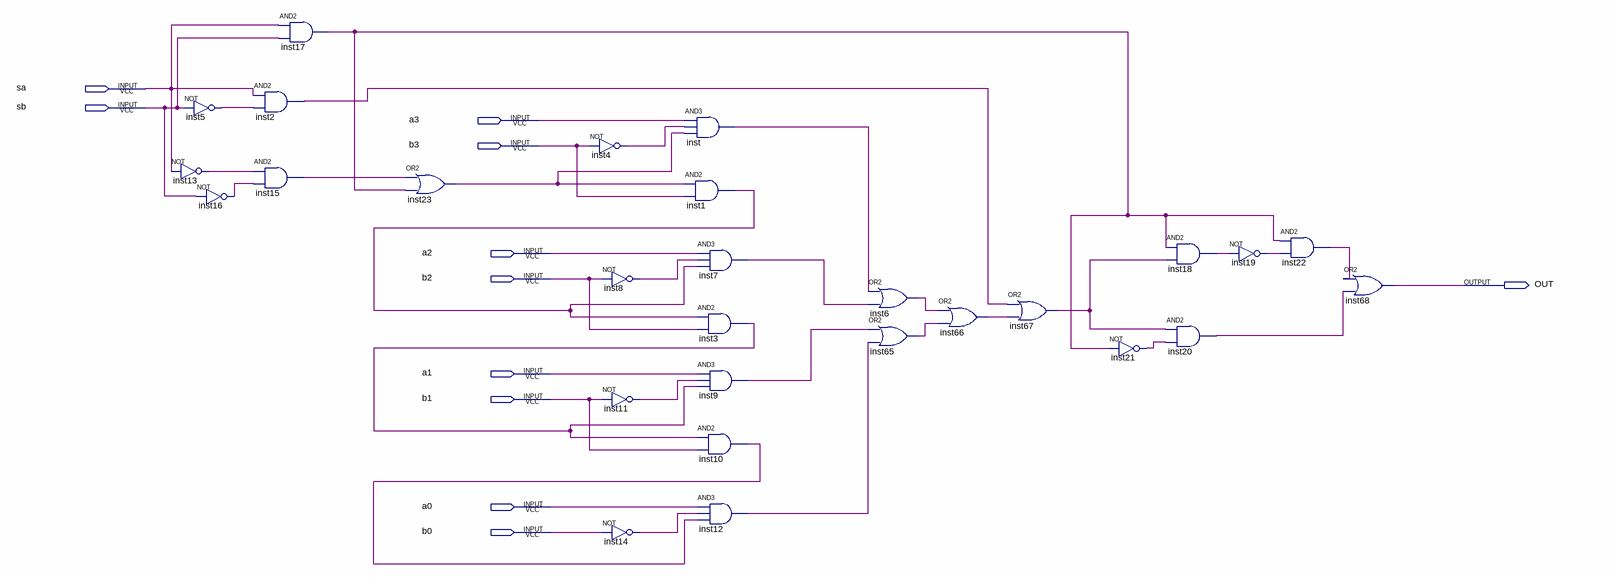
[diagram p0: schematic sheet]
// Quartus schematic maior_que_sinal.bdf as structural Verilog: 28 symbols, 11 pins
module maior_que_sinal (
  input  sa,
  input  sb,
  input  a3,
  input  b3,
  input  a2,
  input  b2,
  input  a1,
  input  b1,
  input  a0,
  input  b0,
  output OUT
);

  wire inst1_out, inst2_out, inst3_out, inst4_out, inst5_out, inst6_out, inst7_out, inst8_out, inst9_out,
       inst10_out, inst11_out, inst12_out, inst13_out, inst14_out, inst15_out, inst16_out, inst17_out,
       inst18_out, inst19_out, inst20_out, inst21_out, inst22_out, inst23_out, inst65_out, inst66_out,
       inst67_out, inst_out;

  not inst5 (inst5_out, sb);
  not inst13 (inst13_out, sa);
  not inst16 (inst16_out, sb);
  and inst2 (inst2_out, sa, inst5_out);
  and inst15 (inst15_out, inst13_out, inst16_out);
  and inst17 (inst17_out, sa, sb);
  or inst23 (inst23_out, inst15_out, inst17_out);
  not inst4 (inst4_out, b3);
  not inst8 (inst8_out, b2);
  not inst11 (inst11_out, b1);
  not inst14 (inst14_out, b0);
  and inst (inst_out, a3, inst4_out, inst23_out);
  and inst1 (inst1_out, inst23_out, b3);
  and inst7 (inst7_out, a2, inst8_out, inst1_out);
  and inst3 (inst3_out, inst1_out, b2);
  and inst9 (inst9_out, a1, inst11_out, inst3_out);
  and inst10 (inst10_out, inst3_out, b1);
  and inst12 (inst12_out, a0, inst14_out, inst10_out);
  or inst6 (inst6_out, inst_out, inst7_out);
  or inst65 (inst65_out, inst9_out, inst12_out);
  or inst66 (inst66_out, inst6_out, inst65_out);
  or inst67 (inst67_out, inst2_out, inst66_out);
  not inst21 (inst21_out, inst17_out);
  and inst18 (inst18_out, inst17_out, inst67_out);
  and inst20 (inst20_out, inst67_out, inst21_out);
  not inst19 (inst19_out, inst18_out);
  and inst22 (inst22_out, inst17_out, inst19_out);
  or inst68 (OUT, inst22_out, inst20_out);
endmodule
